# EAGLE design max696x-breakout (EAGLE 5.06)
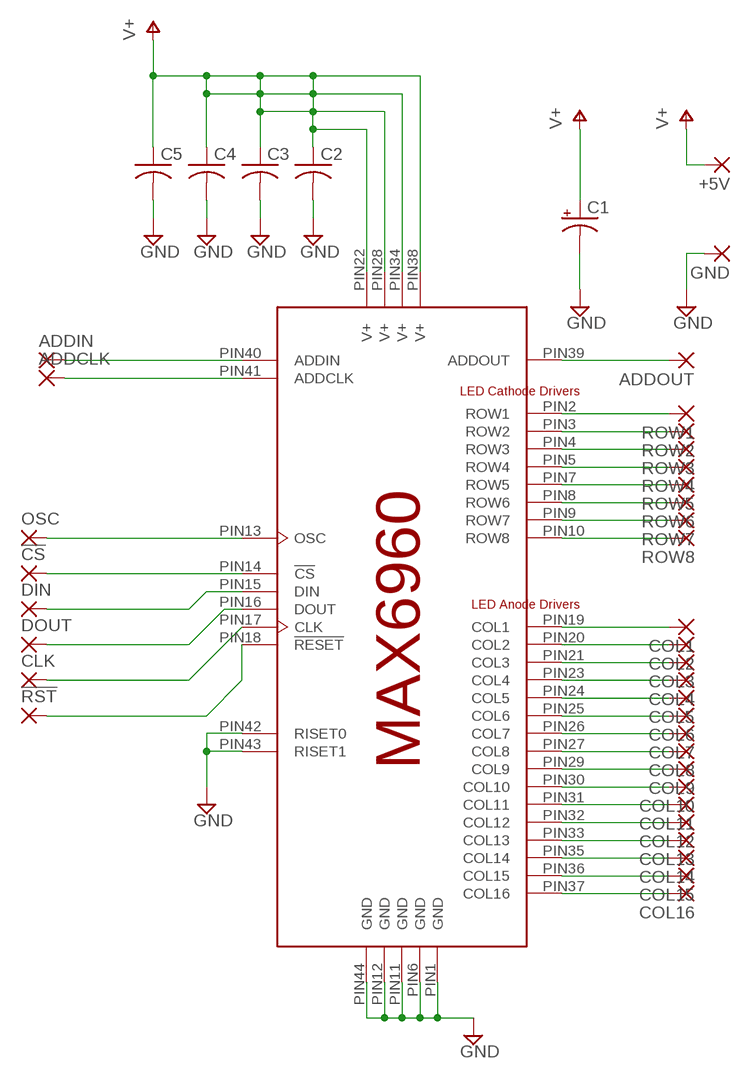
[diagram p0: schematic, sheet 1]

## Parts
!CS  1,6/0,8  [1,6/0,8]
!RST  1,6/0,8  [1,6/0,8]
+5V  1,6/0,8  [1,6/0,8]
ADDCLK  1,6/0,8  [1,6/0,8]
ADDIN  1,6/0,8  [1,6/0,8]
ADDOUT  1,6/0,8  [1,6/0,8]
C1  CPOL-USE2-4  [E2-4]
C2  C-US025-024X044  [C025-024X044]
C3  C-US025-024X044  [C025-024X044]
C4  C-US025-024X044  [C025-024X044]
C5  C-US025-024X044  [C025-024X044]
CLK  1,6/0,8  [1,6/0,8]
COL1  1,6/0,8  [1,6/0,8]
COL2  1,6/0,8  [1,6/0,8]
COL3  1,6/0,8  [1,6/0,8]
COL4  1,6/0,8  [1,6/0,8]
COL5  1,6/0,8  [1,6/0,8]
COL6  1,6/0,8  [1,6/0,8]
COL7  1,6/0,8  [1,6/0,8]
COL8  1,6/0,8  [1,6/0,8]
COL9  1,6/0,8  [1,6/0,8]
COL10  1,6/0,8  [1,6/0,8]
COL11  1,6/0,8  [1,6/0,8]
COL12  1,6/0,8  [1,6/0,8]
COL13  1,6/0,8  [1,6/0,8]
COL14  1,6/0,8  [1,6/0,8]
COL15  1,6/0,8  [1,6/0,8]
COL16  1,6/0,8  [1,6/0,8]
DIN  1,6/0,8  [1,6/0,8]
DOUT  1,6/0,8  [1,6/0,8]
GND  1,6/0,8  [1,6/0,8]
OSC  1,6/0,8  [1,6/0,8]
ROW1  1,6/0,8  [1,6/0,8]
ROW2  1,6/0,8  [1,6/0,8]
ROW3  1,6/0,8  [1,6/0,8]
ROW4  1,6/0,8  [1,6/0,8]
ROW5  1,6/0,8  [1,6/0,8]
ROW6  1,6/0,8  [1,6/0,8]
ROW7  1,6/0,8  [1,6/0,8]
ROW8  1,6/0,8  [1,6/0,8]
U$1  MAX6960-44TQFN  [44TQFN-EP]

## Nets
GND: C1.- C2.2 C3.2 C4.2 C5.2 GND.1(P) U$1.PIN1(GND) U$1.PIN6(GND) U$1.PIN11(GND) U$1.PIN12(GND) U$1.PIN42(RISET0) U$1.PIN43(RISET1) U$1.PIN44(GND)
N$1: ADDOUT.1(P) U$1.PIN39(ADDOUT)
N$2: COL1.1(P) U$1.PIN19(COL1)
N$3: ROW1.1(P) U$1.PIN2(ROW1)
N$4: ROW2.1(P) U$1.PIN3(ROW2)
N$5: ROW3.1(P) U$1.PIN4(ROW3)
N$6: ROW4.1(P) U$1.PIN5(ROW4)
N$7: ROW5.1(P) U$1.PIN7(ROW5)
N$8: ROW6.1(P) U$1.PIN8(ROW6)
N$9: ROW7.1(P) U$1.PIN9(ROW7)
N$10: ROW8.1(P) U$1.PIN10(ROW8)
N$11: COL2.1(P) U$1.PIN20(COL2)
N$12: COL3.1(P) U$1.PIN21(COL3)
N$13: COL4.1(P) U$1.PIN23(COL4)
N$14: COL5.1(P) U$1.PIN24(COL5)
N$15: COL6.1(P) U$1.PIN25(COL6)
N$16: COL7.1(P) U$1.PIN26(COL7)
N$17: COL8.1(P) U$1.PIN27(COL8)
N$18: COL9.1(P) U$1.PIN29(COL9)
N$19: COL10.1(P) U$1.PIN30(COL10)
N$20: COL11.1(P) U$1.PIN31(COL11)
N$21: COL12.1(P) U$1.PIN32(COL12)
N$22: COL13.1(P) U$1.PIN33(COL13)
N$23: COL14.1(P) U$1.PIN35(COL14)
N$24: COL15.1(P) U$1.PIN36(COL15)
N$25: COL16.1(P) U$1.PIN37(COL16)
N$26: !CS.1(P) U$1.PIN14(!CS)
N$27: DIN.1(P) U$1.PIN15(DIN)
N$28: DOUT.1(P) U$1.PIN16(DOUT)
N$29: CLK.1(P) U$1.PIN17(CLK)
N$30: !RST.1(P) U$1.PIN18(!RESET)
N$31: ADDIN.1(P) U$1.PIN40(ADDIN)
N$32: ADDCLK.1(P) U$1.PIN41(ADDCLK)
N$33: OSC.1(P) U$1.PIN13(OSC)
V+: +5V.1(P) C1.+ C2.1 C3.1 C4.1 C5.1 U$1.PIN22(V+) U$1.PIN28(V+) U$1.PIN34(V+) U$1.PIN38(V+)

## Library data of the parts
!CS !RST +5V ADDCLK ADDIN ADDOUT CLK COL1-COL16 DIN DOUT GND OSC ROW1-ROW8 = wirepad:1,6/0,8: THROUGH-HOLE PAD
C1 = resistor:CPOL-US: POLARIZED CAPACITOR, American symbol
C2-C5 = rcl:C-US: CAPACITOR, American symbol
U$1 = Maxim-led:MAX6960-44TQFN: MAX6960 8x8 LED Contriller - Thin QFN no leads

## Board
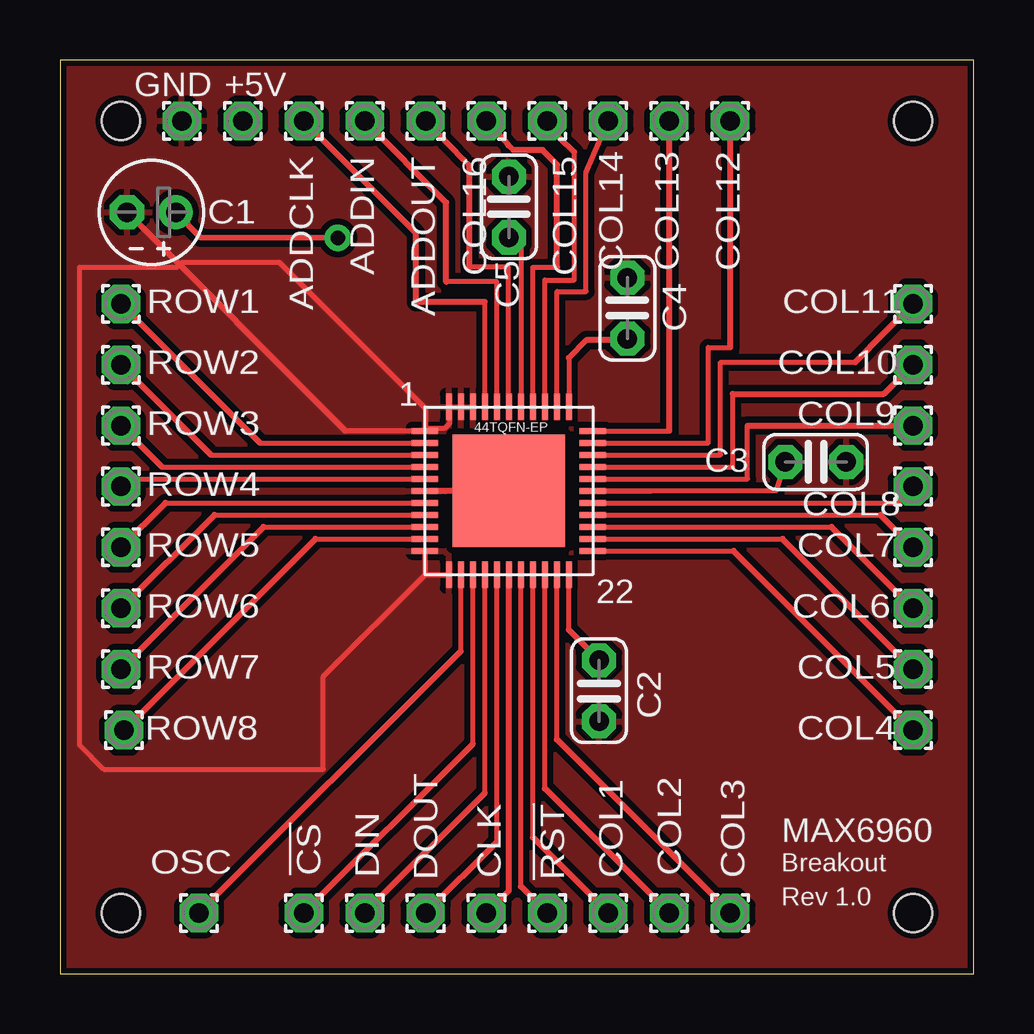
[diagram p1: board, top side]
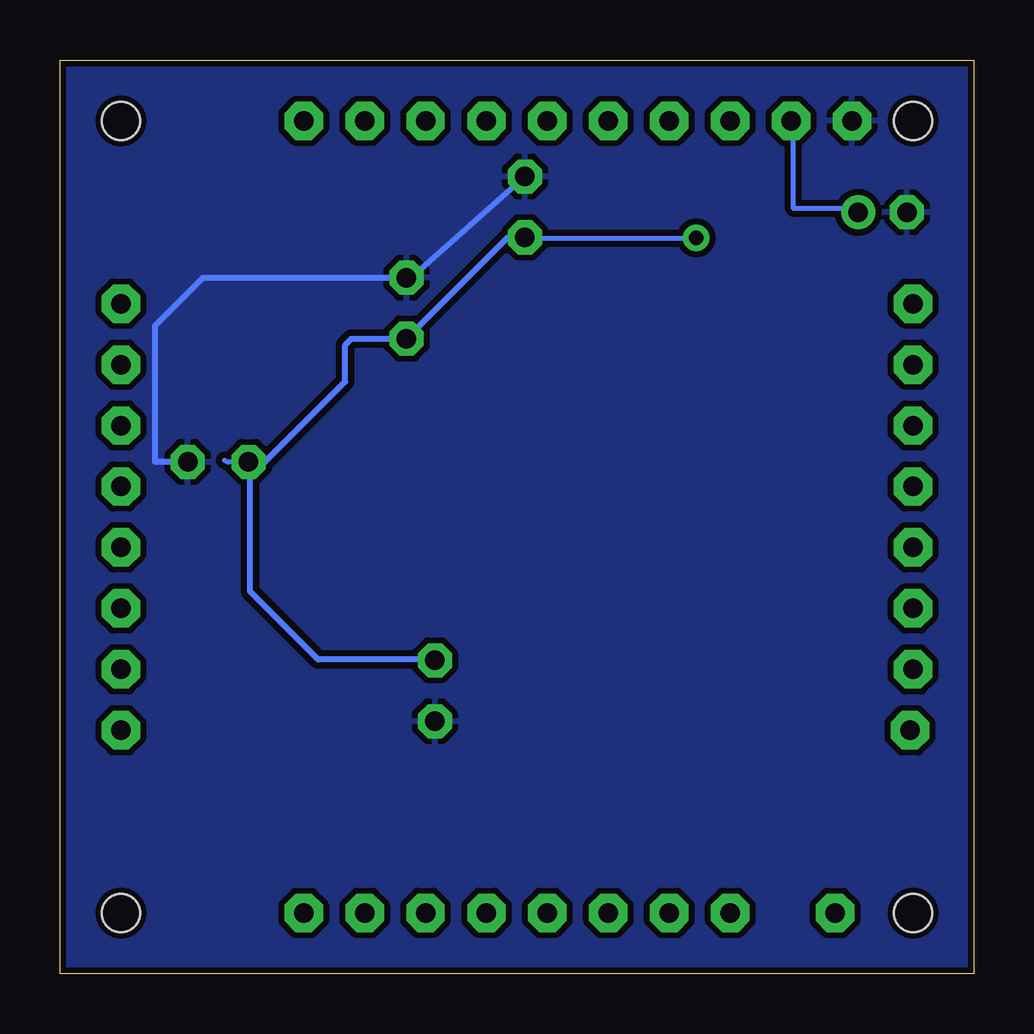
[diagram p2: board, bottom side, seen from below]

Size 38.1 x 38.1 mm. Coordinates in mm from the lower left corner, seen from the top.
Outline: 0,0 38.1,0 38.1,38.1 0,38.1 0,0
Copper layers (1*16): Top 0.035mm / dielectric 1.5mm / Bottom 0.035mm
Design rules "SparkFun": minimum track width 8mil, minimum drill 20mil, track to track 8mil, track to pad 8mil, pad to pad 8mil, via to via 8mil, smd to smd 8mil, copper to edge 10mil, drill to drill 8mil, minimum pad ring 12mil, minimum via ring 10mil, stop-mask expansion 4mil, vias tented up to drill 25mil, thermal gap 10mil
Holes 1.6 mm at 2.54,2.54 35.56,2.54 35.56,35.56 2.54,35.56

### Footprints (pad centres in the part's own frame; a part is rotated, then mirrored left to right if it is on the bottom)
1,6/0,8 = drill 0.813 pad 1.6 octagon: 1 0,0
E2-4 = drill 0.813 pad 1.27 round: + -1.016,0 | drill 0.813 pad 1.27 octagon: - 1.016,0
C025-024X044 = drill 0.813 octagon: 1 -1.27,0; 2 1.27,0
44TQFN-EP = smd 4.7 x 4.7: EP 3.5,3.5 | smd 1.1 x 0.25: PIN1 0,6; PIN2 0,5.5; PIN3 0,5; PIN4 0,4.5; PIN5 0,4; PIN6 0,3.5; PIN7 0,3; PIN8 0,2.5; PIN9 0,2; PIN10 0,1.5; PIN11 0,1; PIN23 7,1; PIN24 7,1.5; PIN25 7,2; PIN26 7,2.5; PIN27 7,3; PIN28 7,3.5; PIN29 7,4; PIN30 7,4.5; PIN31 7,5; PIN32 7,5.5; PIN33 7,6 | smd 0.25 x 1.1: PIN12 1,0; PIN13 1.5,0; PIN14 2,0; PIN15 2.5,0; PIN16 3,0; PIN17 3.5,0; PIN18 4,0; PIN19 4.5,0; PIN20 5,0; PIN21 5.5,0; PIN22 6,0; PIN34 6,7; PIN35 5.5,7; PIN36 5,7; PIN37 4.5,7; PIN38 4,7; PIN39 3.5,7; PIN40 3,7; PIN41 2.5,7; PIN42 2,7; PIN43 1.5,7; PIN44 1,7

### Placement (x,y rotation side)
!CS  10.16,2.54 0 top
!RST  20.32,2.54 0 top
+5V  7.62,35.56 0 top
ADDCLK  10.16,35.56 270 top
ADDIN  12.7,35.56 270 top
ADDOUT  15.24,35.56 270 top
C1  3.81,31.75 180 top
C2  22.47,11.8 270 top
C3  31.51,21.34 0 top
C4  23.65,27.75 90 top
C5  18.72,31.97 90 top
CLK  17.78,2.54 0 top
COL1  22.86,2.54 0 top
COL2  25.4,2.54 0 top
COL3  27.94,2.54 0 top
COL4  35.56,10.16 0 top
COL5  35.56,12.7 0 top
COL6  35.56,15.24 0 top
COL7  35.56,17.78 0 top
COL8  35.56,20.32 0 top
COL9  35.56,22.86 0 top
COL10  35.56,25.4 0 top
COL11  35.56,27.94 0 top
COL12  27.94,35.56 270 top
COL13  25.4,35.56 270 top
COL14  22.86,35.56 270 top
COL15  20.32,35.56 270 top
COL16  17.78,35.56 270 top
DIN  12.7,2.54 0 top
DOUT  15.24,2.54 0 top
GND  5.08,35.56 0 top
OSC  5.79,2.54 0 top
ROW1  2.54,27.94 0 top
ROW2  2.54,25.4 0 top
ROW3  2.54,22.86 0 top
ROW4  2.54,20.32 0 top
ROW5  2.54,17.78 0 top
ROW6  2.54,15.24 0 top
ROW7  2.54,12.7 0 top
ROW8  2.67,10.16 0 top
U$1  15.21,16.64 0 top

### Tracks (layer width: path | path; a pad name or v marks a point on that pad's centre or on a via)
GND
  Top 0.203: U$1.PIN44 16.66,23.64 | 16.66,23.64 U$1.PIN43 | U$1.PIN43 U$1.PIN42 | U$1.PIN44 16.18,23.67 | 11.9,22.64 U$1.PIN1 15.24,22.76 | U$1.PIN43 16.66,23.57 16.66,23.64 | 15.75,20.14 15.65,20.12 15.24,20.12 U$1.PIN6 | 15.24,22.76 16.05,22.76 16.26,22.96 16.26,23.57 U$1.PIN44 | 15.24,16.66 16.26,16.66 U$1.PIN12 | 15.24,16.66 15.24,17.68 U$1.PIN11 | 15.24,22.76 15.24,23.57 9.14,29.67 5.08,29.67 4.88,29.46 0.81,29.46 0.81,9.55 1.83,8.53 10.97,8.53 10.97,12.39 15.24,16.66
  Top 0.254: 11.9,22.64 C1.- | 15.75,20.14 16.76,20.14
  Bottom 0.203: C4.2 23.44,29.02 | C2.2 22.35,10.57
  Bottom 0.254: C4.2 32.14,29.02 34.14,27.03 34.14,21.34 C3.2 | 23.44,29.02 C5.2
  pour Bottom (isolate 0.254): 0,38.1 38.1,38.1 38.1,0 0,0
  pour Top (isolate 0.254): 0,38.1 38.1,38.1 38.1,0 0,0
N$1
  Top 0.203: U$1.PIN39 18.69,23.66 18.69,29.46 17.07,29.46 | 17.07,33.69 16.8,33.95
  Top 0.254: 16.8,33.95 ADDOUT.1 | 17.07,29.46 17.07,33.69
N$2
  Top 0.203: 19.71,5.69 U$1.PIN19
  Top 0.254: 19.71,5.69 COL1.1
N$3
  Top 0.203: 8.34,22.14 U$1.PIN2
  Top 0.254: 8.34,22.14 ROW1.1
N$4
  Top 0.203: 6.3,21.64 U$1.PIN3
  Top 0.254: 6.3,21.64 ROW2.1
N$5
  Top 0.203: 4.26,21.14 U$1.PIN4
  Top 0.254: 4.26,21.14 ROW3.1
N$6
  Top 0.203: ROW4.1 2.86,20.64 U$1.PIN5
N$7
  Top 0.203: 4.4,19.64 U$1.PIN7
  Top 0.254: ROW5.1 4.4,19.64
N$8
  Top 0.203: 6.44,19.14 U$1.PIN8
  Top 0.254: ROW6.1 6.44,19.14
N$9
  Top 0.203: 8.48,18.64 U$1.PIN9
  Top 0.254: ROW7.1 8.48,18.64
N$10
  Top 0.203: 10.65,18.14 U$1.PIN10
  Top 0.254: ROW8.1 10.65,18.14
N$11
  Top 0.203: 20.21,7.73 U$1.PIN20
  Top 0.254: 20.21,7.73 COL2.1
N$12
  Top 0.203: 20.71,9.77 U$1.PIN21
  Top 0.254: 20.71,9.77 COL3.1
N$13
  Top 0.203: U$1.PIN23 28.08,17.64
  Top 0.254: 28.08,17.64 COL4.1
N$14
  Top 0.203: U$1.PIN24 30.12,18.14
  Top 0.254: 30.12,18.14 COL5.1
N$15
  Top 0.203: U$1.PIN25 32.16,18.64
  Top 0.254: 32.16,18.64 COL6.1
N$16
  Top 0.203: U$1.PIN26 34.2,19.14
  Top 0.254: 34.2,19.14 COL7.1
N$17
  Top 0.203: U$1.PIN27 34.88,19.64
  Top 0.254: 34.88,19.64 COL8.1
N$18
  Top 0.203: U$1.PIN29 28.67,20.64 28.67,22.86
  Top 0.254: 28.67,22.86 COL9.1
N$19
  Top 0.203: U$1.PIN30 28.05,21.14 28.05,24.18
  Top 0.254: 28.05,24.18 34.34,24.18 COL10.1
N$20
  Top 0.203: U$1.PIN31 27.53,21.64 27.53,25.5 33.15,25.5
  Top 0.254: 33.15,25.5 COL11.1
N$21
  Top 0.203: U$1.PIN32 27.03,22.14 27.03,26.11 27.94,26.11
  Top 0.254: 27.94,26.11 COL12.1
N$22
  Top 0.203: U$1.PIN33 25.4,22.64
  Top 0.254: 25.4,22.64 COL13.1
N$23
  Top 0.203: U$1.PIN35 20.73,28.45 21.93,28.45 21.93,33.41 COL14.1
N$24
  Top 0.203: 20.21,35.45 arc-90 COL15.1 | U$1.PIN36 20.22,28.93 21.44,28.93 21.44,34.27
  Top 0.254: 21.44,34.27 20.21,35.45
N$25
  Top 0.203: U$1.PIN37 19.71,29.46 20.73,29.46 | 18.9,34.34 18.69,34.54
  Top 0.254: 18.69,34.54 COL16.1 | 18.9,34.34 20.12,34.34 20.73,33.73 20.73,29.46
N$26
  Top 0.203: 17.21,9.59 U$1.PIN14
  Top 0.254: !CS.1 17.21,9.59
N$27
  Top 0.203: 17.71,7.55 U$1.PIN15
  Top 0.254: DIN.1 17.71,7.55
N$28
  Top 0.203: 18.21,5.51 U$1.PIN16
  Top 0.254: DOUT.1 18.21,5.51
N$29
  Top 0.254: CLK.1 18.71,3.47 U$1.PIN17
N$30
  Top 0.203: 19.21,3.65 U$1.PIN18
  Top 0.254: 19.21,3.65 !RST.1
N$31
  Top 0.203: 16.1,28.85 18.21,28.85 U$1.PIN40
  Top 0.254: 16.1,28.85 16.1,32.16 ADDIN.1
N$32
  Top 0.203: U$1.PIN41 17.71,28.01
  Top 0.254: 17.71,28.01 14.83,28.01 14.83,30.89 ADDCLK.1
N$33
  Top 0.203: 16.71,13.46 U$1.PIN13
  Top 0.254: OSC.1 16.71,13.46
V+  (via drill 0.6)
  Top 0.203: C3.1 29.84,20.14 U$1.PIN28 24.66,20.14 | 21.21,14.33 21.21,14.35 U$1.PIN22 | 21.21,25.68 U$1.PIN34 | C4.1 23.59,26.42 | C2.1 22.35,13.21 | U$1.PIN38 19.21,30.7 C5.1
  Top 0.254: 21.21,25.68 21.95,26.42 23.59,26.42 | v11.58,30.68 5.87,30.7 C1.+ | 22.35,13.21 21.21,14.35
  Bottom 0.203: 31.25,21.4 31.09,21.34 30.28,21.34 C3.1 | 19.43,30.7 C5.1 19.2,30.68 v11.58,30.68 | 22.55,13.01 C2.1 22.55,13.11 | 29.57,21.34 30.18,21.34 C3.1 | 30.18,21.23 C3.1 | C1.+ 4.88,31.9 7.52,31.9 7.52,35.56 +5V.1
  Bottom 0.254: 19.43,30.7 C4.1 25.94,26.48 26.21,26.21 26.21,24.69 29.57,21.34 | 22.55,13.11 27.33,13.11 30.18,15.95 30.18,21.23

### Text on the board
tPlace: 1 | 22 | MAX6960 | Breakout | Rev 1.0